# Altium schematic sheet GPSDO_V2.0.SchDoc
size 457 x 330 mm
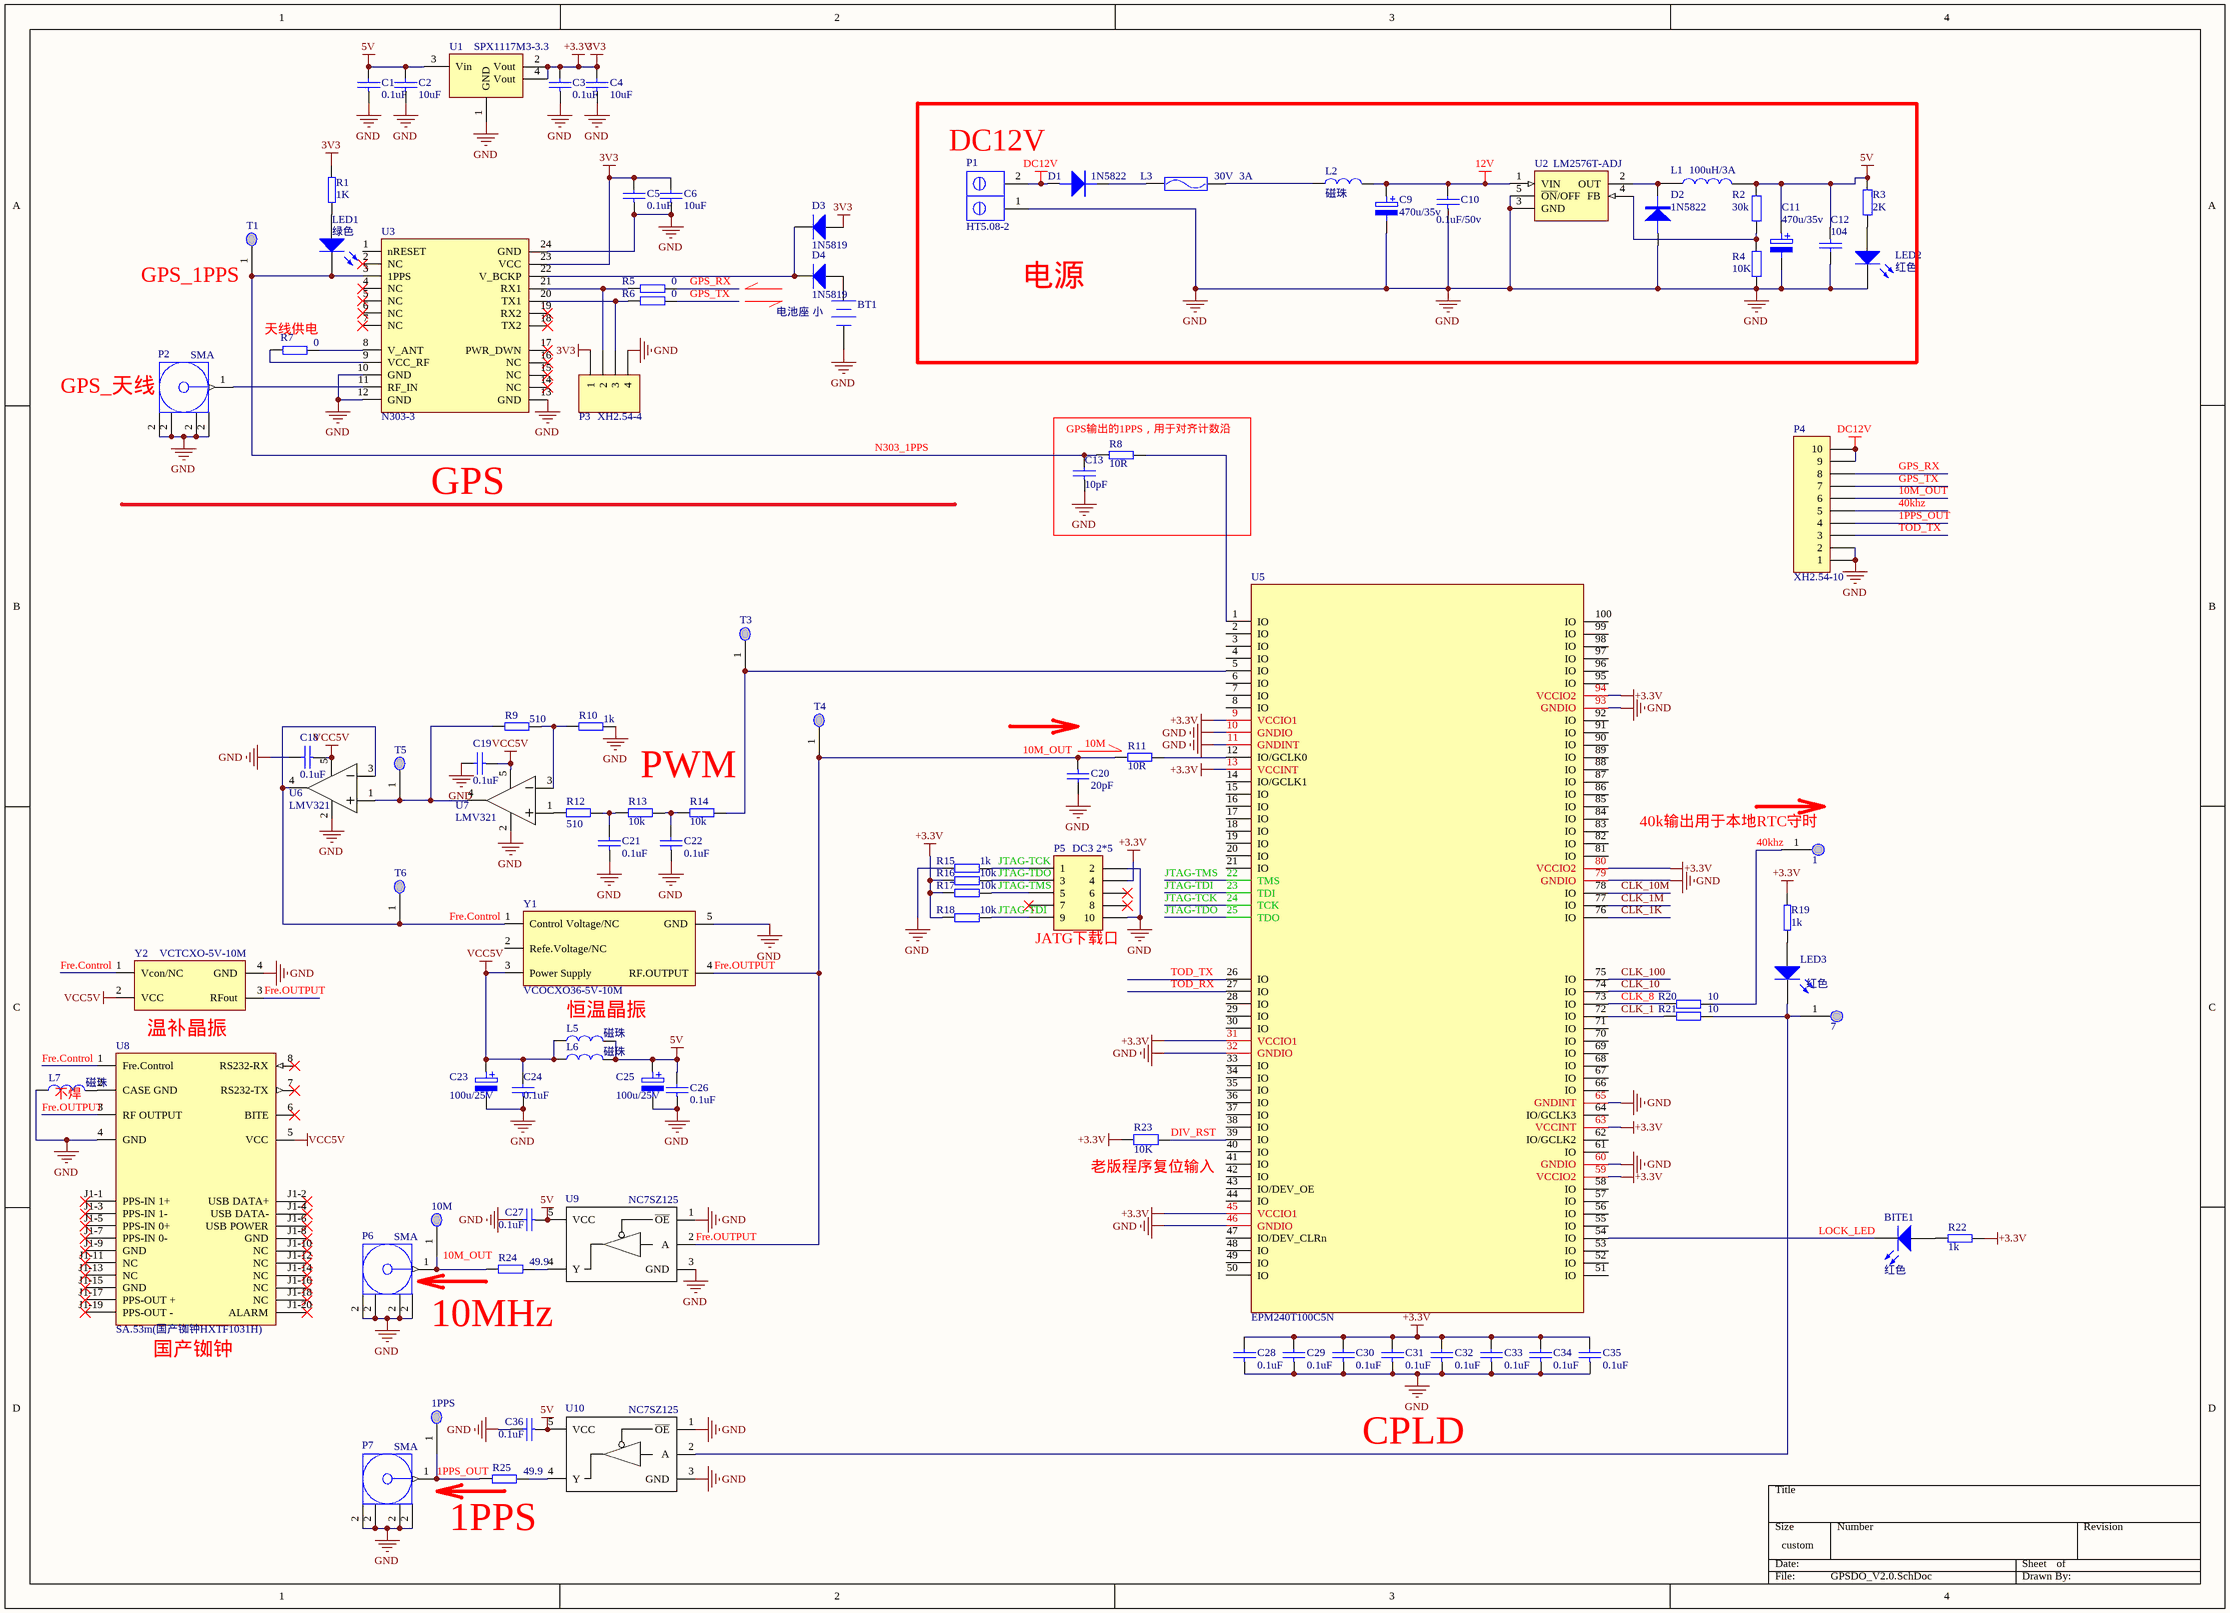
[diagram p0: GPSDO_V2.0.SchDoc]

## Parts
1  TEST  [测试点（圆形）]  (value not drawn)
1PPS  TEST  [测试点（圆形）]  (value not drawn)
7  TEST  [测试点（圆形）]  (value not drawn)
10M  TEST  [测试点（圆形）]  (value not drawn)
BITE1  红色  [LED0805]
BT1  电池座 小  [电池座 2032  直插]
C1  0.1uF  [0805]
C2  10uF  [1206]
C3  0.1uF  [0805]
C4  10uF  [1206]
C5  0.1uF  [0805]
C6  10uF  [1206]
C9  470u/35v  [电容 铝电解 470U/35V]
C10  0.1uF/50v  [0805]
C11  470u/35v  [电容 铝电解 470U/35V]
C12  104  [0805]
C13  10pF  [0805]
C18  0.1uF  [0805]
C19  0.1uF  [0805]
C20  20pF  [0805]
C21  0.1uF  [0805]
C22  0.1uF  [0805]
C23  100u/25V  [1206]
C24  0.1uF  [0805]
C25  100u/25V  [1206]
C26  0.1uF  [0805]
C27  0.1uF  [0805]
C28  0.1uF  [0805]
C29  0.1uF  [0805]
C30  0.1uF  [0805]
C31  0.1uF  [0805]
C32  0.1uF  [0805]
C33  0.1uF  [0805]
C34  0.1uF  [0805]
C35  0.1uF  [0805]
C36  0.1uF  [0805]
D1  1N5822  [二极管 贴片 4007]
D2  1N5822  [二极管 贴片 4007]
D3  1N5819  [二极管 贴片 IN4148]
D4  1N5819  [二极管 贴片 IN4148]
L1  100uH/3A  [电感 贴片 12*12]
L2  磁珠  [磁珠 直插]
L3  30V  3A  [30V/4A 自恢复保险]
L5  磁珠  [0805]
L6  磁珠  [0805]
L7  磁珠  [0805]
LED1  绿色  [LED0805]
LED2  红色  [Led0805]
LED3  红色  [LED0805]
P1  HT5.08-2  [KF128L-5.08-2P]
P2  SMA  [天线座 50ohm 直立]
P3  XH2.54-4  [VH2.54_4]
P4  XH2.54-10  [VH2.54_10]
P5  封装: DC3 2*5  [双排插针 2.54 2*5]  (hidden comment: DC3压线座)
P6  SMA  [天线座 50ohm 直立]
P7  SMA  [天线座 50ohm 直立]
R1  1K  [0805]
R2  30k  [0805]
R3  2K  [0805]
R4  10K  [0805]
R5  0  [0805]
R6  0  [0805]
R7  0  [0805]
R8  10R  [0805]
R9  510  [0805]
R10  1k  [0805]
R11  10R  [0805]
R12  510  [0805]
R13  10k  [0805]
R14  10k  [0805]
R15  1k  [0805]
R16  10k  [0805]
R17  10k  [0805]
R18  10k  [0805]
R19  1k  [0805]
R20  10  [0805]
R21  10  [0805]
R22  1k  [0805]
R23  10K  [0805]
R24  49.9  [0805]
R25  49.9  [0805]
T1  TEST  [测试点（圆形）]  (value not drawn)
T3  TEST  [测试点（圆形）]  (value not drawn)
T4  TEST  [测试点（圆形）]  (value not drawn)
T5  TEST  [测试点（圆形）]  (value not drawn)
T6  TEST  [测试点（圆形）]  (value not drawn)
U1  SPX1117M3-3.3  [SOT223]
U2  LM2576T-ADJ  [TO220 LM2576-YA30]
U3  N303-3  [模块 N303-3]
U5  EPM240T100C5N  [TQFP100]
U6  LMV321  [SOT23-5]
U7  LMV321  [SOT23-5]
U8  SA.53m(国产铷钟HXTF1031H)  [模块 SA.53m]
U9  NC7SZ125  [SOT23-5]
U10  NC7SZ125  [SOT23-5]
Y1  VCOCXO36-5V-10M  [模块 VCOCXO36-12V-10M]
Y2  VCTCXO-5V-10M  [模块 VCTCXO-5V-10M]

## Blocks framed on the sheet
GPS输出的1PPS，用于对齐计数沿: C13 R8

## Nets
5V: C1.2 C2.2 C11.1 C12.1 C25.1 C26.2 C27.1 C36.1 L1.2 L5.2 L6.2 R2.2 R3.1 U1.3(Vin) U9.5(VCC) U10.5(VCC)
12V: C9.1 C10.2 L2.2 U2.1(VIN)
+3.3V: C3.2 C4.2 C5.2 C6.2 C28.2 C29.2 C30.2 C31.2 C32.2 C33.2 C34.2 C35.2 D3.1(A) P3.1 P5.4 R1.1 R16.2 R17.2 R18.2 R19.1 R22.2 R23.2 U1.2(Vout) U1.4(Vout) U3.23(VCC) U5.9(VCCIO1) U5.13(VCCINT) U5.31(VCCIO1) U5.45(VCCIO1) U5.59(VCCIO2) U5.63(VCCINT) U5.80(VCCIO2) U5.94(VCCIO2)  [also labelled 3V3]
DC12V: D1.1(A) P1.2 P4.9 P4.10
GND: BT1.2(-) C1.1 C2.1 C3.1 C4.1 C5.1 C6.1 C9.2 C10.1 C11.2 C12.2 C13.1 C18.2 C19.2 C20.2 C21.1 C22.1 C23.2 C24.1 C25.2 C26.1 C27.2 C28.1 C29.1 C30.1 C31.1 C32.1 C33.1 C34.1 C35.1 C36.2 D2.1(A) L7.1 LED2.2(K) P1.1 P2.2 P3.4 P4.1 P4.2 P5.2 P5.10 P6.2 P7.2 R4.1 R10.1 R15.1 U1.1(GND) U2.3(GND) U2.5(~{ON}/OFF) U3.10(GND) U3.12(GND) U3.13(GND) U3.24(GND) U5.10(GNDIO) U5.11(GNDINT) U5.32(GNDIO) U5.46(GNDIO) U5.60(GNDIO) U5.65(GNDINT) U5.79(GNDIO) U5.93(GNDIO) U6.2(GND) U7.2(GND) U8.4(GND) U9.1(~{OE}) U9.3(GND) U10.1(~{OE}) U10.3(GND) Y1.5(GND) Y2.4(GND)
VCC5V: C18.1 C19.1 C23.1 C24.2 L5.1 L6.1 U6.5(VCC) U7.5(VCC) U8.5(VCC) Y1.3(Power_Supply) Y2.2(VCC)
1PPS_OUT: 1PPS.1 P4.4 P7.1(Signal) R25.2
10M_OUT: C20.1 P4.6 R11.2 T4.1 U8.3(RF_OUTPUT) U9.2(A) Y1.4(RF.OUTPUT) Y2.3(RFout)  [also labelled Fre.OUTPUT]
40khz: 1.1 P4.5 R20.1
CLK_1: R21.2 U5.72(IO)
CLK_1K: U5.76(IO)
CLK_1M: U5.77(IO)
CLK_8: R20.2 U5.73(IO)
CLK_10: U5.74(IO)
CLK_10M: U5.78(IO)
CLK_100: U5.75(IO)
DIV_RST: R23.1 U5.39(IO)
Fre.Control: T6.1 U6.3(IN-) U6.4(OUT) U8.1(Fre.Control) Y1.1(Control_Voltage/NC) Y2.1(Vcon/NC)
GPS_RX: P4.8 R5.1
GPS_TX: P4.7 R6.1
JTAG-TCK: P5.1 R15.2 U5.24(TCK)
JTAG-TDI: P5.9 R18.1 U5.23(TDI)
JTAG-TDO: P5.3 R16.1 U5.25(TDO)
JTAG-TMS: P5.5 R17.1 U5.22(TMS)
LOCK_LED: BITE1.2(K) U5.54(IO)
N303_1PPS: C13.2 LED1.2(K) R8.2 T1.1 U3.3(1PPS)
TOD_RX: U5.27(IO)
TOD_TX: P4.3 U5.26(IO)
Net7_1: 7.1 LED3.2(K) R21.1 U10.2(A)
Net10M_1: 10M.1 P6.1(Signal) R24.2
NetBITE1_1: BITE1.1(A) R22.1
NetBT1_1: BT1.1(+) D4.1(A)
NetC21_2: C21.2 R12.1 R13.2
NetC22_2: C22.2 R13.1 R14.2
NetD1_2: D1.2(K) L3.1
NetD2_2: D2.2(K) L1.1 U2.2(OUT)
NetD3_2: D3.2(K) D4.2(K) U3.22(V_BCKP)
NetL2_1: L2.1 L3.2
NetL7_2: L7.2 U8.2(CASE_GND)
NetLED1_1: LED1.1(A) R1.2
NetLED2_1: LED2.1(A) R3.2
NetLED3_1: LED3.1(A) R19.2
NetP2_1: P2.1(Signal) U3.11(RF_IN)
NetP3_2: P3.2 R5.2 U3.21(RX1)
NetP3_3: P3.3 R6.2 U3.20(TX1)
NetR2_1: R2.1 R4.2 U2.4(FB)
NetR7_1: R7.1 U3.8(V_ANT)
NetR7_2: R7.2 U3.9(VCC_RF)
NetR8_1: R8.1 U5.1(IO)
NetR9_1: R9.1 R10.2 U7.3(IN-)
NetR9_2: R9.2 T5.1 U6.1(IN+) U7.4(OUT)
NetR11_1: R11.1 U5.12(IO/GCLK0)
NetR12_2: R12.2 U7.1(IN+)
NetR14_1: R14.1 T3.1 U5.5(IO)
NetR24_1: R24.1 U9.4(Y)
NetR25_1: R25.1 U10.4(Y)

Not connected (* = marked no-connect by the designer): P5 6* 7* 8*; U3 1(nRESET) 2(NC)* 4(NC)* 5(NC)* 6(NC)* 7(NC)* 14(NC)* 15(NC)* 16(NC)* 17(PWR_DWN)* 18(TX2)* 19(RX2)*; U5 2(IO) 3(IO) 4(IO) 6(IO) 7(IO) 8(IO) 14(IO/GCLK1) 15(IO) 16(IO) 17(IO) 18(IO) 19(IO) 20(IO) 21(IO) 28(IO) 29(IO) 30(IO) 33(IO) 34(IO) 35(IO) 36(IO) 37(IO) 38(IO) 40(IO) 41(IO) 42(IO) 43(IO/DEV_OE) 44(IO) 47(IO/DEV_CLRn) 48(IO) 49(IO) 50(IO) 51(IO) 52(IO) 53(IO) 55(IO) 56(IO) 57(IO) 58(IO) 61(IO) 62(IO/GCLK2) 64(IO/GCLK3) 66(IO) 67(IO) 68(IO) 69(IO) 70(IO) 71(IO) 81(IO) 82(IO) 83(IO) 84(IO) 85(IO) 86(IO) 87(IO) 88(IO) 89(IO) 90(IO) 91(IO) 92(IO) 95(IO) 96(IO) 97(IO) 98(IO) 99(IO) 100(IO); U8 6(BITE)* 7(RS232-TX)* 8(RS232-RX)* J1-1(PPS-IN_1+)* J1-2(USB_DATA+)* J1-3(PPS-IN_1-)* J1-4(USB_DATA-)* J1-5(PPS-IN_0+)* J1-6(USB_POWER)* J1-7(PPS-IN_0-)* J1-8(GND)* J1-9(GND)* J1-10(NC)* J1-11(NC)* J1-12(NC)* J1-13(NC)* J1-14(NC)* J1-15(GND)* J1-16(NC)* J1-17(PPS-OUT_+)* J1-18(NC)* J1-19(PPS-OUT_-)* J1-20(ALARM)*; Y1 2(Refe.Voltage/NC)

## Notes on the sheet
- (near P1) DC12V
- (near T1) GPS_1PPS
- (near R7) 天线供电
- 电源
- (near P2) GPS_天线
- GPS
- 10M
- PWM
- 40k输出用于本地RTC守时
- (near P5) JATG下载口
- 恒温晶振
- 温补晶振
- (near L7) 不焊
- (near R23) 老版程序复位输入
- (near U8) 国产铷钟
- 10MHz
- CPLD
- (near R25) 1PPS
- Labels drawn without touching a wire or pin: 10M_OUT

## Library data of the parts
1 1PPS 7 10M T1 T3-T6 = 测试点_小: 单位: 个; 名称: 测试点; 封装: 直插
BITE1 LED1-LED3 = 贴片发光二极管 0805: 封装: 0805; 单位: 个; 名称: 贴片发光二极管
C1 C3 C5 C10 C13 C18-C22 C24 C26-C36 = 电容 贴片 0805: 名称: 贴片电容; 单位: 个; 封装: 0805
C2 C4 C6 = 电容 贴片 0805: 名称: 贴片电容; 封装: 0805; 单位: 个
C9 = 电容 直插 电解  470u/35v: 名称: 电解电容; 封装: 直插; 单位: 个
C11 = 电解电容 470u/35v: 名称: 电解电容; 封装: 贴片; 单位: 个
C12 = 贴片电容 0805: 名称: 贴片电容; 单位: 个; 封装: 0805
C23 C25 = 电容 贴片 铝电解 470u/25V: 名称: 贴片铝电解电容; 封装: 贴片; 单位: 个
D1 D2 = 二极管 1N5822: 名称: 二极管; 封装: 直插; 单位: 个
D3 D4 = 二极管 贴片 1N4148: 名称: 贴片二极管; 封装: 贴片; 单位: 个
L1 = 电感 330uH/3A: 名称: 电感; 封装: 分立; 单位: 个
L2 = 磁珠: 封装: 0805; 单位: 个; 名称: 磁珠
L3 = 保险 自恢复: 单位: 个; 封装: 0805; 名称: 自恢复保险管
L5-L7 = 磁珠: 单位: 个; 名称: 磁珠; 封装: 0805
P1 = 连接件 HT5.08-2: 名称: 连接件; 单位: 套; 封装: HT5.08-2
P2 P6 P7 = 连接件 天线座 SMA: 单位: 个; 封装: 直插; 名称: 联接件
P3 = 联结件 XH2.54-4: 名称: 联结件; 单位: 套; 封装: XH2.54-4
P4 = 连接件 XH2.54-10: 名称: 连接件; 单位: 套; 封装: XH2.54-10
P5 = 联结件 DC3 2*5: 名称: 联结件; 单位: 个
R1 R5-R22 R24 R25 = 电阻 贴片 0805: 名称: 贴片电阻; 单位: 个; 封装: 0805
R2-R4 R23 = 贴片电阻 0805: 名称: 贴片电阻; 单位: 个; 封装: 0805
U1 = 贴片芯片 SPX1117M3-3.3: LDO; 名称: 贴片芯片; 单位: 个; 封装: SOT223
U2 = 贴片芯片 LM2575T-ADJ: 名称: 芯片; 封装: 直插; 单位: 个
U3 = 模块 N303-3: 单位: 个; 名称: 模块; 封装: 贴片
U6 U7 = 贴片芯片 LMV321: 单位: 个; 名称: 芯片; 封装: SOT23-5
U8 = 模块 SA.53m: 封装: 直插; 单位: 个; 名称: 晶振
U9 U10 = 贴片芯片 NC7SZ125: 超高速缓冲; 单位: 个; 名称: 芯片; 封装: SOT23-5
Y1 = 模块 恒温VCOCXO36-12V 10M: 封装: 直插; 名称: 晶振; 单位: 个
Y2 = 模块 VCTCXO-5V-10M: 名称: 晶振; 单位: 个; 封装: 直插
BT1 = 电池座 小: Published: 24-Mar-1999; LatestRevisionDate: 17-Jul-2002; LatestRevisionNote: Re-released for DXP Platform.; PackageReference: BAT-2; Publisher: Altium Limited